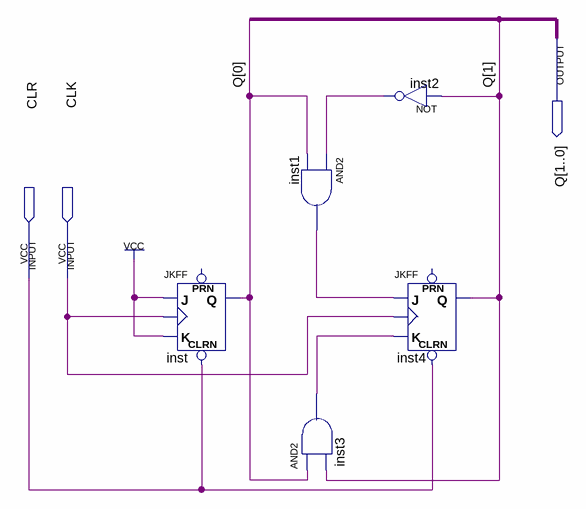
[diagram p0: schematic sheet]
// Quartus schematic Count4.bdf as structural Verilog: 5 symbols, 3 pins
module Count4 (
  input  CLR,
  input  CLK,
  output [1:0] Q
);

  wire inst1_out, inst2_out, inst3_out;

  JKFF inst (.CLRN(CLR), .K(1'b1), .J(1'b1), .CLK(CLK), .Q(Q[0]));  // open: PRN
  and inst1 (inst1_out, inst2_out, Q[0]);
  and inst3 (inst3_out, Q[0], Q[1]);
  not inst2 (inst2_out, Q[1]);
  JKFF inst4 (.CLRN(CLR), .K(inst3_out), .J(inst1_out), .CLK(CLK), .Q(Q[1]));  // open: PRN
endmodule
